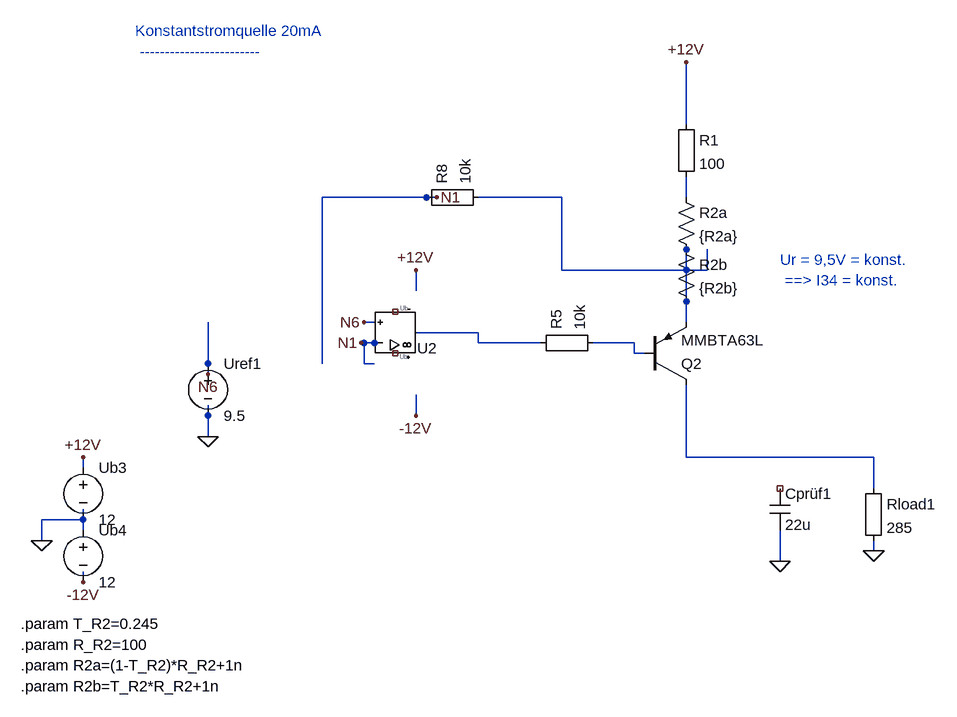
[diagram p0: schematic 20mA_Konstantstromquelle.asc]
20mA_Konstantstromquelle.asc, the LTspice schematic file:
Version 4
SHEET 1 880 680
WIRE 160 832 160 816
WIRE 608 560 592 560
WIRE 592 560 592 592
WIRE 592 592 608 592
WIRE 672 544 768 544
WIRE 768 544 768 560
WIRE 160 928 160 912
WIRE 352 672 352 656
WIRE 1024 576 1008 576
WIRE 1008 576 1008 560
WIRE 1088 528 1088 480
WIRE 1232 848 1232 864
WIRE 160 736 160 752
WIRE 160 848 160 832
WIRE 96 864 96 832
WIRE 96 832 160 832
WIRE 672 448 672 480
WIRE 672 672 672 640
WIRE 1088 224 1088 128
WIRE 1088 336 1088 304
WIRE 1088 416 1088 448
WIRE 1120 416 1120 448
WIRE 1120 448 1088 448
WIRE 352 592 352 528
WIRE 352 704 352 656
WIRE 1376 864 1376 880
WIRE 944 560 1008 560
WIRE 864 560 768 560
WIRE 1088 480 1088 448
WIRE 528 592 528 336
WIRE 528 336 688 336
WIRE 768 336 896 336
WIRE 896 336 896 448
WIRE 896 448 1088 448
WIRE 1232 896 1232 864
WIRE 1088 624 1088 736
WIRE 1088 736 1376 736
WIRE 1376 736 1376 784
WIRE 352 592 352 608
WIRE 608 528 592 528
WIRE 608 560 588 560
WIRE 688 336 704 336
FLAG 96 864 0
FLAG 352 704 0
FLAG 1376 880 0
FLAG 1232 896 0
FLAG 96 864 0
FLAG 352 704 0
FLAG 1376 880 0
FLAG 1232 896 0
FLAG 160 736 +12V
FLAG 672 448 +12V
FLAG 1088 128 +12V
FLAG 160 928 -12V
FLAG 672 672 -12V
FLAG 352 608 N6
FLAG 592 528 N6
FLAG 588 560 N1
FLAG 704 336 N1
SYMBOL voltage 160 736 R0
SYMATTR InstName Ub3
SYMATTR Value 12
SYMBOL UniversalOpAmp2 640 544 M180
SYMATTR InstName U2
SYMATTR Value UniversalOpAmp2
SYMBOL voltage 160 832 R0
SYMATTR InstName Ub4
SYMATTR Value 12
SYMBOL Misc\EuropeanResistor 1072 208 R0
SYMATTR InstName R1
SYMATTR Value 100
SYMBOL res 1072 320 R0
SYMATTR InstName R2a
SYMATTR Value {R2a}
SYMBOL res 1072 400 R0
SYMATTR InstName R2b
SYMATTR Value {R2b}
SYMBOL voltage 352 576 R0
SYMATTR InstName Uref1
SYMATTR Value 9.5
SYMBOL Misc\EuropeanResistor 1360 768 R0
SYMATTR InstName Rload1
SYMATTR Value 285
SYMBOL pnp 1024 624 M180
SYMATTR InstName Q2
SYMATTR Value MMBTA63L
SYMBOL Misc\EuropeanResistor 848 576 R270
SYMATTR InstName R5
SYMATTR Value 10k
SYMBOL Misc\EuropeanResistor 672 352 R270
SYMATTR InstName R8
SYMATTR Value 10k
SYMBOL cap 1216 784 R0
SYMATTR InstName Cprüf1
SYMATTR Value 22u
TEXT 64 992 Left 2 !.param T_R2=0.245
TEXT 64 1024 Left 2 !.param R_R2=100
TEXT 64 1056 Left 2 !.param R2a=(1-T_R2)*R_R2+1n
TEXT 64 1088 Left 2 !.param R2b=T_R2*R_R2+1n
TEXT 240 80 Left 2 ;Konstantstromquelle 20mA \n ------------------------
TEXT 1232 432 Left 2 ;Ur = 9,5V = konst. \n ==> I34 = konst.

The netlist it stands for:
* 20mA_Konstantstromquelle.asc
V§Ub3 +12V 0 12
XU2 N6 N1 NC_01 NC_02 N001 level2 UniversalOpAmp2 Avol=1Meg GBW=10Meg Slew=10Meg Ilimit=25m Rail=0 Vos=0 En=0 Enk=0 In=0 Ink=0 Rin=500Meg  ; pins In+ In- V+ V- OUT
V§Ub4 0 -12V 12
R1 +12V N004 100
R2a N004 N003 {R2a}
R2b N003 N003 {R2b}
V§Uref1 N6 0 9.5
Rload1 N005 0 285
Q2 N005 N002 N003 0 MMBTA63L
R5 N001 N002 10k
R8 N1 N003 10k
Cprüf1 NC_03 0 22u
.model NPN NPN
.model PNP PNP
.lib standard.bjt
.param T_R2=0.245
.param R_R2=100
.param R2a=(1-T_R2)*R_R2+1n
.param R2b=T_R2*R_R2+1n
* Konstantstromquelle 20mA
*  ------------------------
* Ur = 9,5V = konst.
*  ==> I34 = konst.
.lib UniversalOpAmp2.lib
.backanno
.end